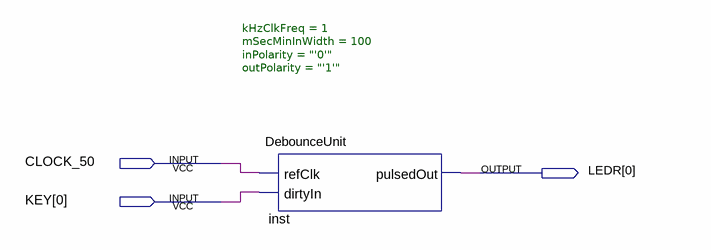
[diagram p0: schematic sheet]
// Quartus schematic teste.bdf as structural Verilog: 1 symbols, 3 pins
module teste (
  input  CLOCK_50,
  input  [0:0] KEY,
  output [0:0] LEDR
);

  DebounceUnit #(.kHzClkFreq(1), .mSecMinInWidth(100), .inPolarity("'0'"), .outPolarity("'1'")) inst (
    .refClk(CLOCK_50), .dirtyIn(KEY[0]), .pulsedOut(LEDR[0]));
endmodule
